# Altium schematic sheet CongSuat_SCH.SchDoc
size A3
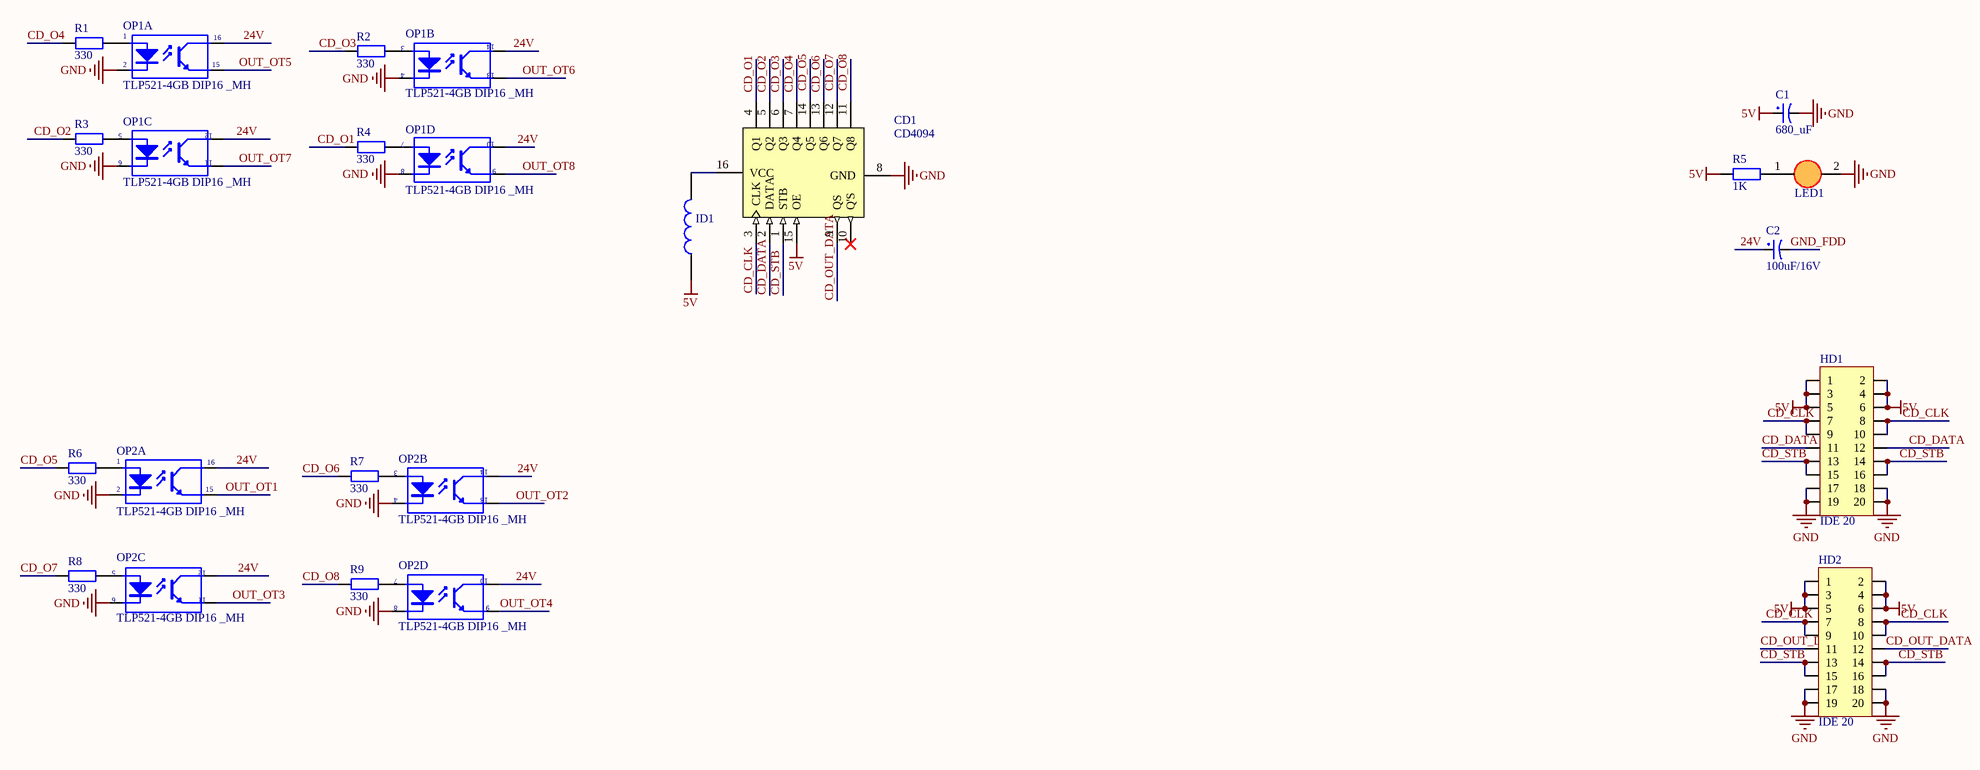
[diagram p0: CongSuat_SCH.SchDoc]

## Parts
C1  680_uF  [TU_HOA(100uF/35V - 470uF/16V)]
C2  100uF/16V  [TU_HOA(100uF/35V - 470uF/16V)]
CD1  CD4094  [DIP16]
HD1  IDE 20  [CABLE 20]
HD2  IDE 20  [CABLE 20]
ID1  Inductor 0805_MH  [TU_SMD_0805]  (value not drawn)
LED1  LED3  [LED 3mm Do]  (value not drawn)
OP1  TLP521-4GB DIP16 _MH  [DIP16]  (parts A,B,C,D of 4)
OP2  TLP521-4GB DIP16 _MH  [DIP16]  (parts A,B,C,D of 4)
R1  330  [Tro SMD 0805]
R2  330  [Tro SMD 0805]
R3  330  [Tro SMD 0805]
R4  330  [Tro SMD 0805]
R5  1K  [Tro SMD 0805]
R6  330  [Tro SMD 0805]
R7  330  [Tro SMD 0805]
R8  330  [Tro SMD 0805]
R9  330  [Tro SMD 0805]

## Nets
5V: C1.1 CD1.15(OE) HD1.1 HD1.2 HD1.3 HD1.4 HD1.5 HD1.6 HD2.1 HD2.2 HD2.3 HD2.4 HD2.5 HD2.6 ID1.1 R5.1
GND: C1.2 CD1.8(GND) HD1.17 HD1.18 HD1.19 HD1.20 HD2.17 HD2.18 HD2.19 HD2.20 LED1.2(K) OP1.2(K) OP1.4(K) OP1.6(K) OP1.8(K) OP2.2(K) OP2.4(K) OP2.6(K) OP2.8(K)
24V: C2.1 OP1.10(C) OP1.12(C) OP1.14(C) OP1.16(C) OP2.10(C) OP2.12(C) OP2.14(C) OP2.16(C)
CD_CLK: CD1.3(CLK) HD1.7 HD1.8 HD1.9 HD1.10 HD2.7 HD2.8 HD2.9 HD2.10
CD_DATA: CD1.2(DATA) HD1.11 HD1.12
CD_O1: CD1.4(Q1) R4.1
CD_O2: CD1.5(Q2) R3.1
CD_O3: CD1.6(Q3) R2.1
CD_O4: CD1.7(Q4) R1.1
CD_O5: CD1.14(Q5) R6.1
CD_O6: CD1.13(Q6) R7.1
CD_O7: CD1.12(Q7) R8.1
CD_O8: CD1.11(Q8) R9.1
CD_OUT_DATA: CD1.9(QS) HD2.11 HD2.12
CD_STB: CD1.1(STB) HD1.13 HD1.14 HD1.15 HD1.16 HD2.13 HD2.14 HD2.15 HD2.16
GND_FDD: C2.2
OUT_OT1: OP2.15(E)
OUT_OT2: OP2.13(E)
OUT_OT3: OP2.11(E)
OUT_OT4: OP2.9(E)
OUT_OT5: OP1.15(E)
OUT_OT6: OP1.13(E)
OUT_OT7: OP1.11(E)
OUT_OT8: OP1.9(E)
NetCD1_16: CD1.16(VCC) ID1.2
NetLED1_1: LED1.1(A) R5.2
NetOP1_1: OP1.1(A) R1.2
NetOP1_3: OP1.3(A) R2.2
NetOP1_5: OP1.5(A) R3.2
NetOP1_7: OP1.7(A) R4.2
NetOP2_1: OP2.1(A) R6.2
NetOP2_3: OP2.3(A) R7.2
NetOP2_5: OP2.5(A) R8.2
NetOP2_7: OP2.7(A) R9.2

Not connected (* = marked no-connect by the designer): CD1 10(Q'S)*

## Notes on the sheet
- Title
- Size:
- Date:
- A3
- Number:
- Time:
- Revision:
- Sheet
- of
- File:

## Library data of the parts
C1 = TU_HOA_680_uF_25V_MH: TU_HOA_680_uF_25V; Value: 100uF/35V/50V; Description 1: 1000uF/6,3V - 470uF/16V - 330uF - 25V; Description 2: 220uF/35V - 100uF/50V - 63V - 4,7uF/200V; Description 3: 22uF => 33uF100V - 3,3uF => 4,7uF/250V; Description 4: 2,2uF =>3,3uF/350 - 2,2uF/400V - 1uF/450V
C2 = TU_HOA_100uF_50V_MH: TU_HOA_100uF_50V; Value: 100uF/35V/50V; Description 1: 1000uF/6,3V - 470uF/16V - 330uF - 25V; Description 2: 220uF/35V - 100uF/50V - 63V - 4,7uF/200V; Description 3: 22uF => 33uF100V - 3,3uF => 4,7uF/250V; Description 4: 2,2uF =>3,3uF/350 - 2,2uF/400V - 1uF/450V
HD1 HD2 = IDE 20: IDE header 20P
ID1 = Inductor 0805_MH: cuon cam 0805
LED1 = LED 3mm_MH: LED 3mm
R1-R9 = TRO_SMD_0805_MH: TRO_SMD_0805
OP1 OP2 = TLP521-4GB DIP16 _MH: Value: TLP521-4